# Altium schematic sheet Display.SchDoc
size A4
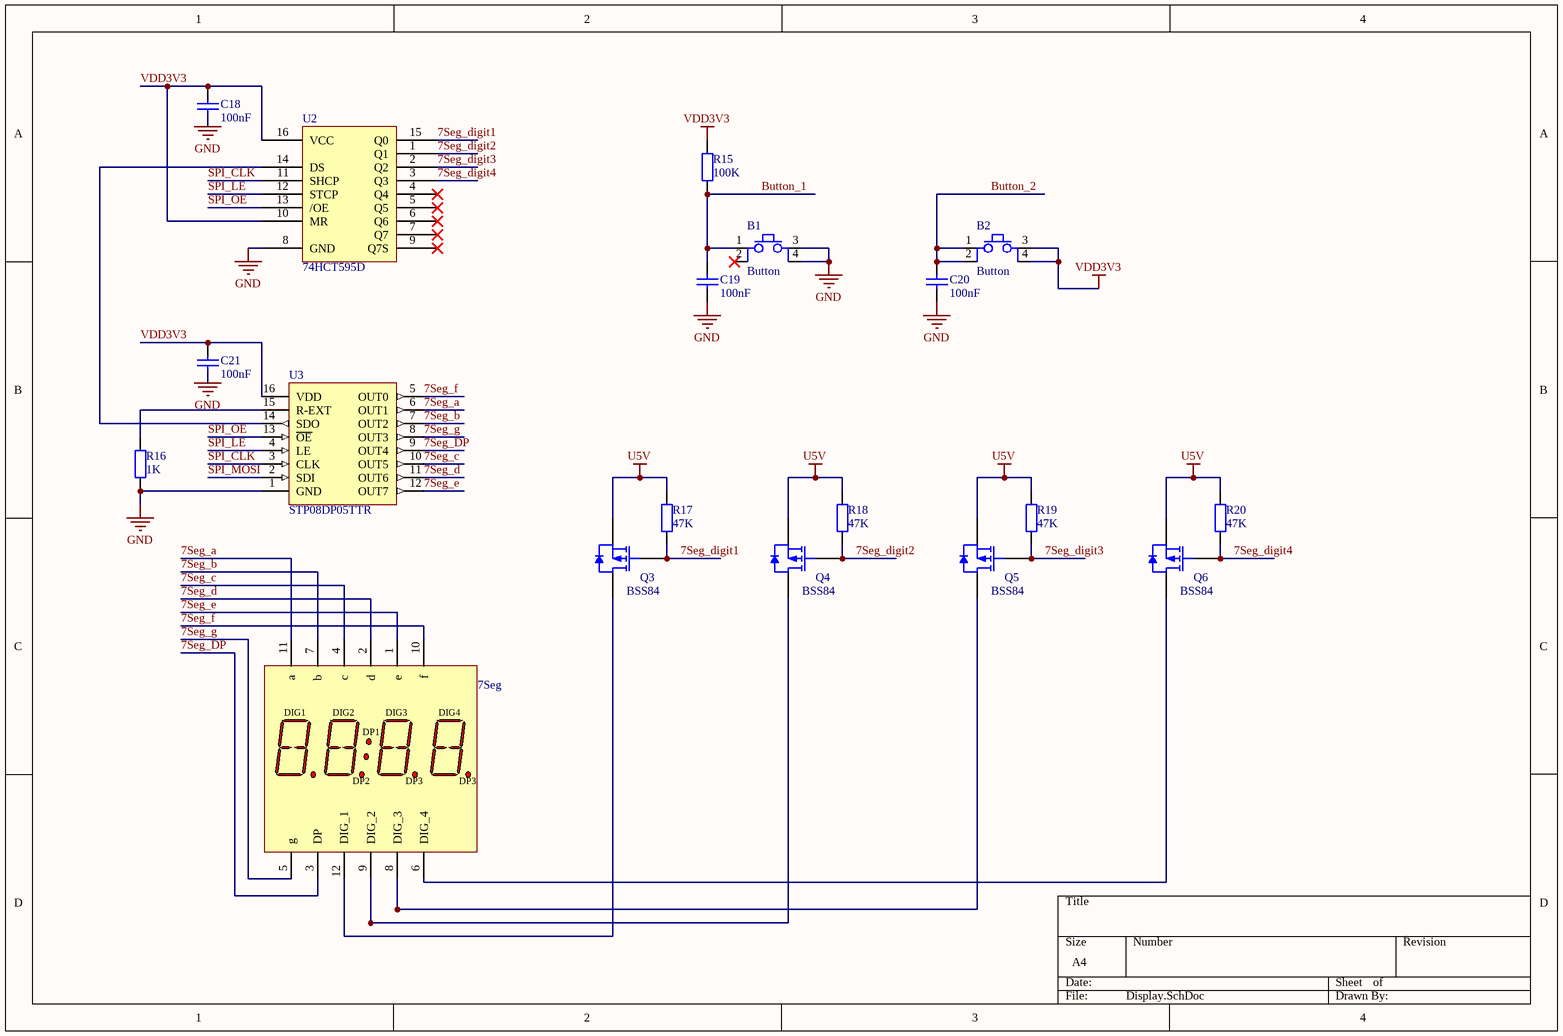
[diagram p0: Display.SchDoc]

## Parts
7Seg  4 digit, 12 pin  [7SEG-12pin]  (value not drawn)
B1  Button  [FP_BTN_SMD]
B2  Button  [FP_BTN_SMD]
C18  100nF  [FP_0805_CAP_085]
C19  100nF  [FP_0805_CAP_085]
C20  100nF  [FP_0805_CAP_085]
C21  100nF  [FP_0805_CAP_085]
Q3  BSS84  [SOT23_N]
Q4  BSS84  [SOT23_N]
Q5  BSS84  [SOT23_N]
Q6  BSS84  [SOT23_N]
R15  100K  [FP_0805_RES]
R16  1K  [FP_0805_RES]
R17  47K  [FP_0805_RES]
R18  47K  [FP_0805_RES]
R19  47K  [FP_0805_RES]
R20  47K  [FP_0805_RES]
U2  74HCT595D  [SOP127P600X175-16M]
U3  STP08DP05TTR  [TSOP65P640X120-16M]

## Nets
GND: B1.3 B1.4 C18.1 C19.1 C20.1 C21.1 R16.1 U2.8(GND) U3.1(GND)
U5V: Q3.2(S) Q4.2(S) Q5.2(S) Q6.2(S) R17.2 R18.2 R19.2 R20.2
VDD3V3: B2.3 B2.4 C18.2 C21.2 R15.2 U2.10(MR) U2.16(VCC) U3.16(VDD)
7Seg_a: 7Seg.11(a) U3.6(OUT1)
7Seg_b: 7Seg.7(b) U3.7(OUT2)
7Seg_c: 7Seg.4(c) U3.10(OUT5)
7Seg_d: 7Seg.2(d) U3.11(OUT6)
7Seg_digit1: Q3.1(G) R17.1 U2.15(Q0)
7Seg_digit2: Q4.1(G) R18.1 U2.1(Q1)
7Seg_digit3: Q5.1(G) R19.1 U2.2(Q2)
7Seg_digit4: Q6.1(G) R20.1 U2.3(Q3)
7Seg_DP: 7Seg.3(DP) U3.9(OUT4)
7Seg_e: 7Seg.1(e) U3.12(OUT7)
7Seg_f: 7Seg.10(f) U3.5(OUT0)
7Seg_g: 7Seg.5(g) U3.8(OUT3)
Button_1: B1.1 C19.2 R15.1
Button_2: B2.1 B2.2 C20.2
SPI_CLK: U2.11(SHCP) U3.3(CLK)
SPI_LE: U2.12(STCP) U3.4(LE)
SPI_MOSI: U3.2(SDI)
SPI_OE: U2.13(/OE) U3.13(~{OE})
Net7Seg_6: 7Seg.6(DIG_4) Q6.3(D)
Net7Seg_8: 7Seg.8(DIG_3) Q5.3(D)
Net7Seg_9: 7Seg.9(DIG_2) Q4.3(D)
Net7Seg_12: 7Seg.12(DIG_1) Q3.3(D)
NetR16_2: R16.2 U3.15(R-EXT)
NetU2_14: U2.14(DS) U3.14(SDO)

Not connected (* = marked no-connect by the designer): B1 2*; U2 4(Q4)* 5(Q5)* 6(Q6)* 7(Q7)* 9(Q7S)*

## Notes on the sheet
- (in symbol 7SEG_4Digit_12pin) DIG1; DIG2; DIG3; DIG4; DP1; DP2; DP3

## Library data of the parts
7Seg = 7SEG_4Digit_12pin
B1 B2 = Button: Push button; Reference: 3801305; Name: FSM4JSMA; Supplier: Farnell
C18-C21 = CAP 100nF: Capacitor; Tolerance: +80%/-20%; Voltage: 25V; Reference: 1759167; Name: SMD Multilayer Ceramic Capacitor, 0805; Supplier: Farnell; Value: 100nF
Q3-Q6 = BSS84: P-channel Enhancement Mode Vertical D-MOSFET; Name: FAIRCHILD SEMICONDUCTOR  BSS84  MOSFET Transistor, P Channel, -130 mA, -50 V, 1.2 ohm, -5 V, -1.7 V; Reference: 1094997; PackageReference: SOT23; PackageDescription: 3-Pin SOT-23 Package 0.95 mm Pitch, 2.3 mm Lead Span; Supplier: Farnell
R15 = RES 100K: Resistor; Tolerance: 5%; Power: 125mW; Name: YAGEO (PHYCOMP)  RC0805JR-07100KL  SMD Chip Resistor, Thick Film, 100 kohm; Reference: 9234250; Supplier: Farnell; Value: 100K
R16 = RES 1K: Resistor; Tolerance: 5%; Power: 125mW; Name: YAGEO (PHYCOMP)  RC0805JR-071KL  SMD Chip Resistor, Thick Film, 1 kohm; Reference: 9234004; Supplier: Farnell; Value: 1K
R17-R20 = RES 47K: Resistor; Tolerance: 5%; Power: 125mW; Name: YAGEO (PHYCOMP)  RC0805JR-0747KL  SMD Chip Resistor, Thick Film, 47 kohm; Reference: 9234217; Supplier: Farnell; Value: 47K
U2 = 74HCT595D: Name: NEXPERIA  74HCT595D  Shift Register, HCT Family, 74HCT595, Serial to Parallel, Serial to Serial, 8 Element, 8 bit, SOIC; Reference: 2098004; Supplier: Farnell
U3 = STP08DP05TTR: Low voltage, low current power 8-bit shift register; Reference: 2460707; Name: STMICROELECTRONICS  STP08DP05TTR  Led Driver, 8 Outputs, Constant Current, 3V-5.5V; Supplier: Farnell